# Altium schematic sheet Sheet1.SchDoc
size A2; SheetNumber: 1; SheetTotal: 1
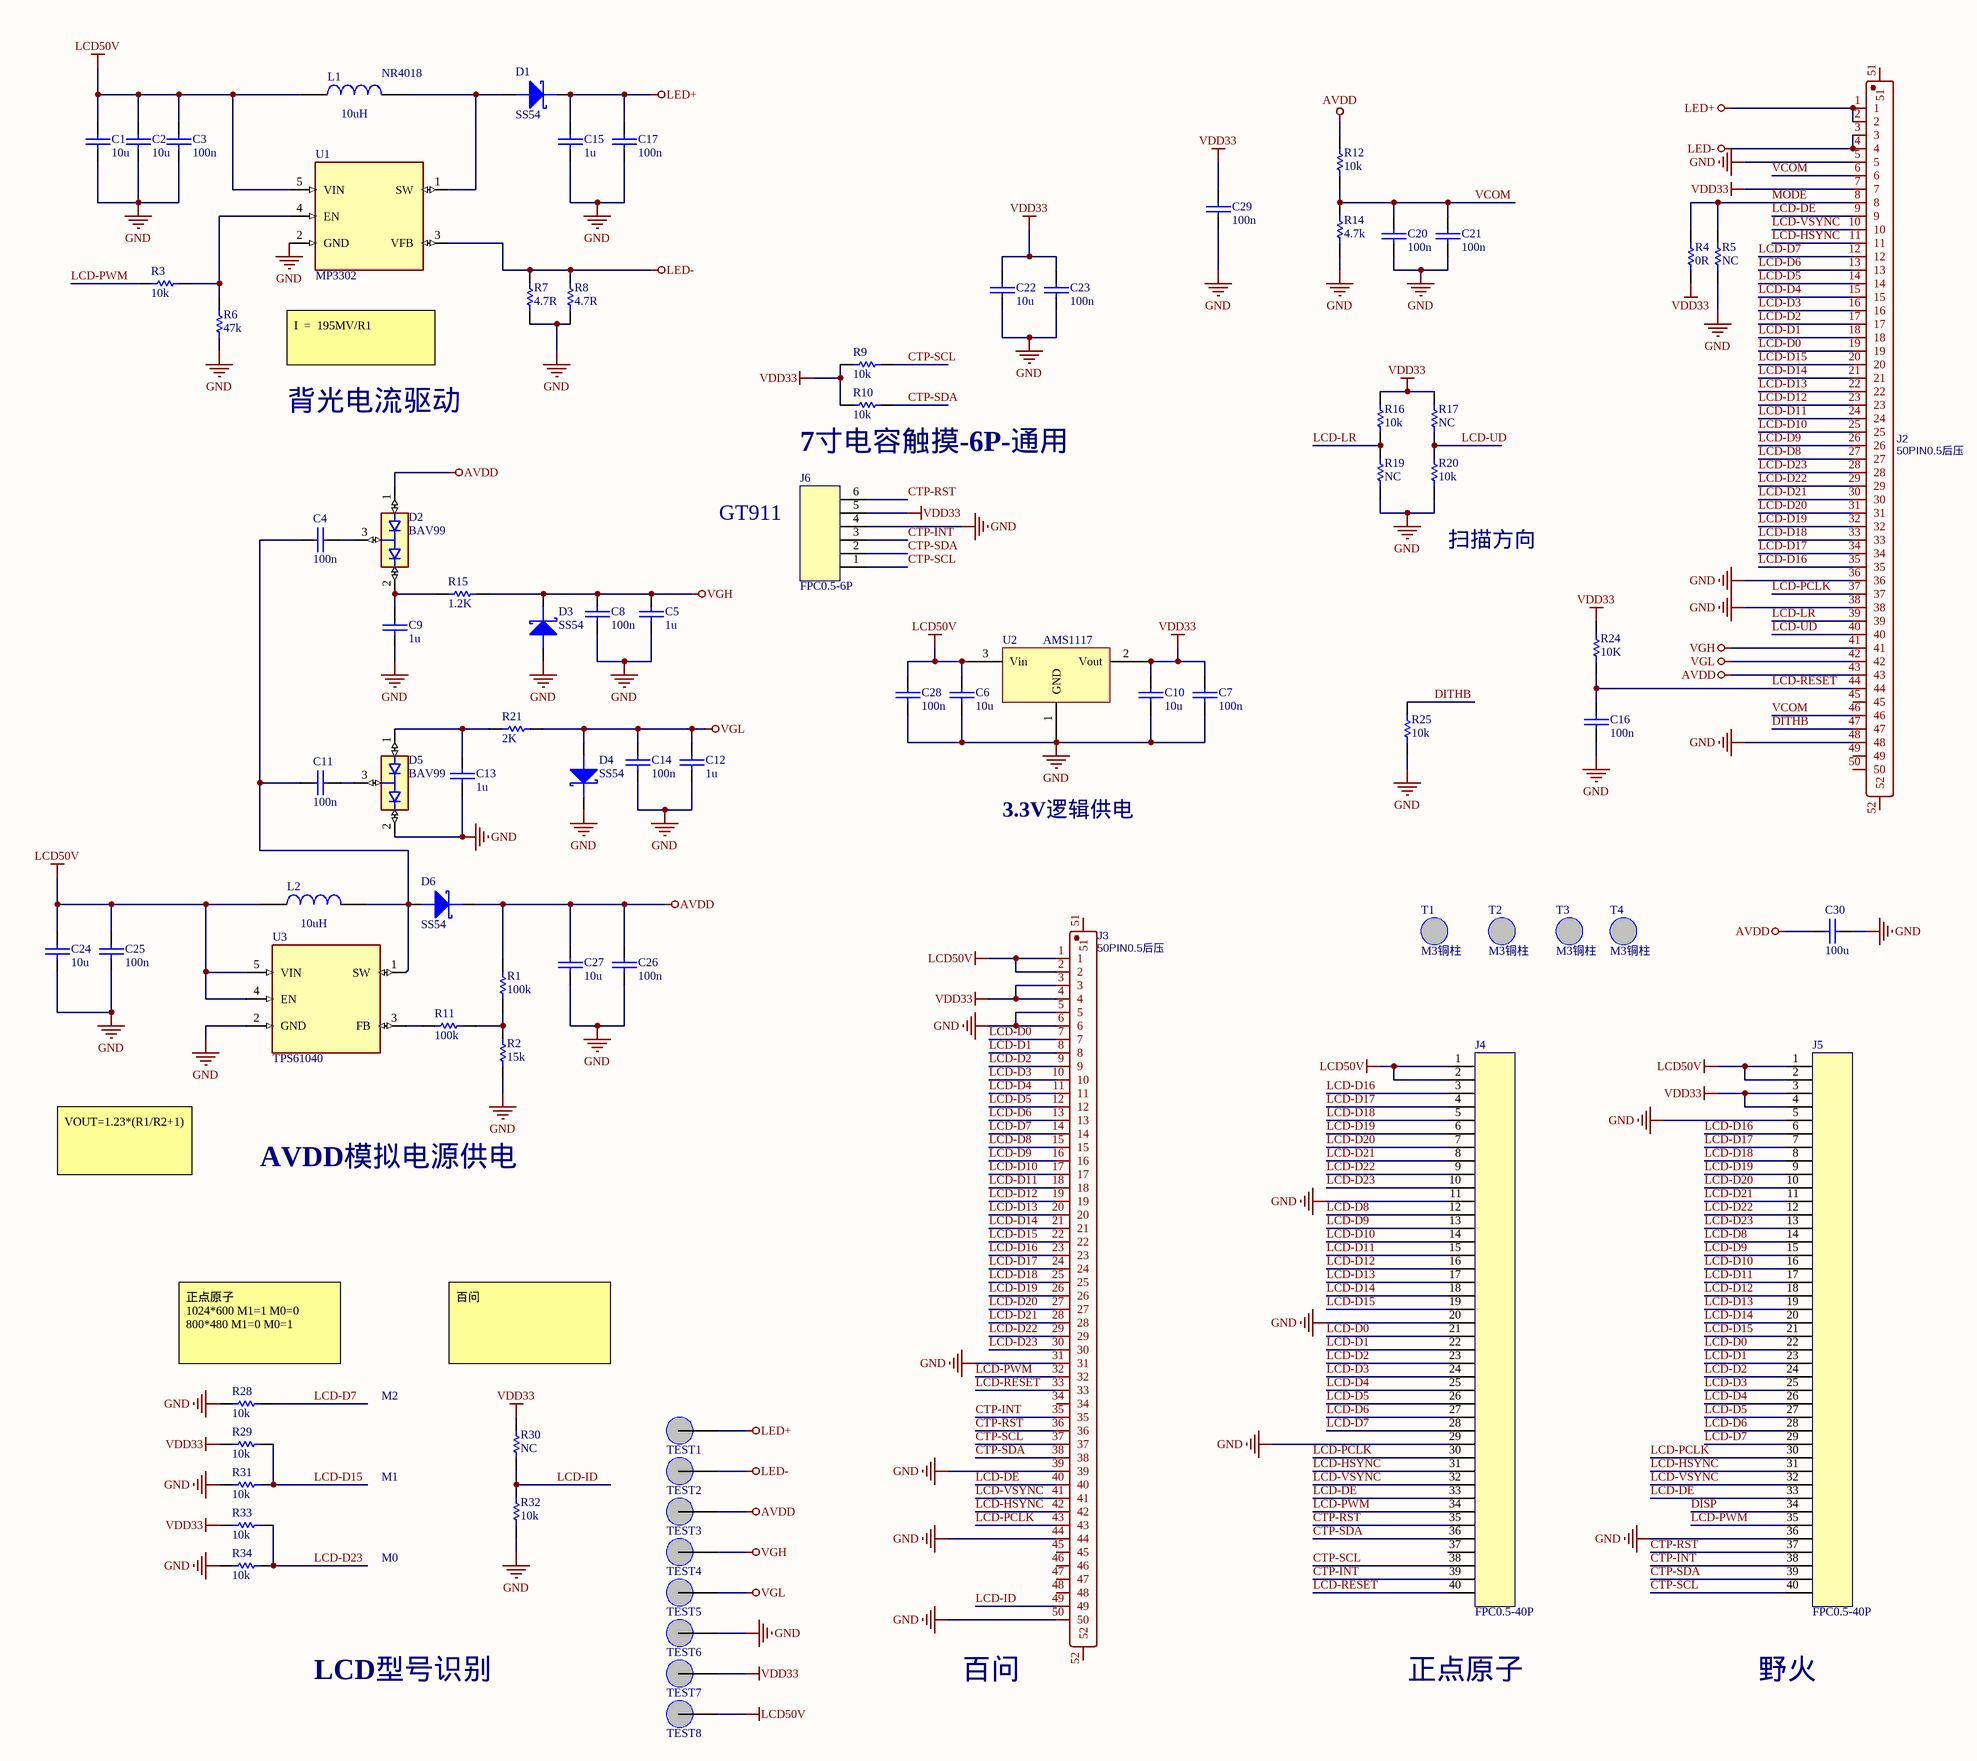
[diagram p0: Sheet1.SchDoc]

## Parts
C1  10u  [0603C]
C2  10u  [0603C]
C3  100n  [0603C]
C4  100n  [0603C]
C5  1u  [0603C]
C6  10u  [0603C]
C7  100n  [0603C]
C8  100n  [0603C]
C9  1u  [0603C]
C10  10u  [0603C]
C11  100n  [0603C]
C12  1u  [0603C]
C13  1u  [0603C]
C14  100n  [0603C]
C15  1u  [0603C]
C16  100n  [0603C]
C17  100n  [0603C]
C20  100n  [0603C]
C21  100n  [0603C]
C22  10u  [0603C]
C23  100n  [0603C]
C24  10u  [0603C]
C25  100n  [0603C]
C26  100n  [0603C]
C27  10u  [0603C]
C28  100n  [0603C]
C29  100n  [0603C]
C30  100u  [0603C]
D1  SS54  [SOD-123]
D2  BAV99  [SOT23-3]
D3  SS54  [SOD-123]
D4  SS54  [SOD-123]
D5  BAV99  [SOT23-3]
D6  SS54  [SOD-123]
J2  50PIN0.5后压  [FPC-SMD_KH-FG0.5-H2.0-50PIN]
J3  50PIN0.5后压  [FPC-SMD_KH-FG0.5-H2.0-50PIN]
J4  FPC0.5-40P  [FPC0.5-40P]
J5  FPC0.5-40P  [FPC0.5-40P]
J6  FPC0.5-6P  [FPC0.5-6P]
L1  10uH  [CD42]
L2  10uH  [CD42]
R1  100k  [0603R]
R2  15k  [0603R]
R3  10k  [0603R]
R4  0R  [0603R]
R5  NC  [0603R]
R6  47k  [0603R]
R7  4.7R  [0603R]
R8  4.7R  [0603R]
R9  10k  [0603R]
R10  10k  [0603R]
R11  100k  [0603R]
R12  10k  [0603R]
R14  4.7k  [0603R]
R15  1.2K  [0603R]
R16  10k  [0603R]
R17  NC  [0603R]
R19  NC  [0603R]
R20  10k  [0603R]
R21  2K  [0603R]
R24  10K  [0603R]
R25  10k  [0603R]
R28  10k  [0603R]
R29  10k  [0603R]
R30  NC  [0603R]
R31  10k  [0603R]
R32  10k  [0603R]
R33  10k  [0603R]
R34  10k  [0603R]
T1  M3铜柱  [M3 单孔]
T2  M3铜柱  [M3 单孔]
T3  M3铜柱  [M3 单孔]
T4  M3铜柱  [M3 单孔]
TEST1  TEST  [TEST SMALL]  (value not drawn)
TEST2  TEST  [TEST SMALL]  (value not drawn)
TEST3  TEST  [TEST SMALL]  (value not drawn)
TEST4  TEST  [TEST SMALL]  (value not drawn)
TEST5  TEST  [TEST SMALL]  (value not drawn)
TEST6  TEST  [TEST SMALL]  (value not drawn)
TEST7  TEST  [TEST SMALL]  (value not drawn)
TEST8  TEST  [TEST SMALL]  (value not drawn)
U1  MP3302  [SOT95P280X100-5N]
U2  AMS1117  [SOT223]
U3  TPS61040  [SOT95P280X100-5N]

## Nets
AVDD: C26.2 C27.2 C30.1 D2.1(A1) D6.K J2.43 R1.1 R12.1 TEST3.1
GND: C1.1 C2.1 C3.1 C5.1 C6.1 C7.1 C8.1 C9.1 C10.1 C12.1 C13.2 C14.1 C15.1 C16.1 C17.1 C20.1 C21.1 C22.1 C23.1 C24.1 C25.1 C26.1 C27.1 C28.1 C29.1 C30.2 D3.A D4.K D5.2(C2) J2.5 J2.36 J2.38 J2.48 J3.5 J3.6 J3.31 J3.39 J3.44 J3.50 J4.11 J4.20 J4.29 J5.5 J5.36 J6.4 R2.1 R5.2 R6.1 R7.1 R8.1 R14.2 R19.2 R20.2 R25.2 R28.1 R31.2 R32.1 R34.2 TEST6.1 U1.2(GND) U2.1(GND) U3.2(GND)
LCD50V: C1.2 C2.2 C3.2 C6.2 C24.2 C25.2 C28.2 J3.1 J3.2 J4.1 J4.2 J5.1 J5.2 L1.1 L2.1 TEST8.1 U1.5(VIN) U2.3(Vin) U3.4(EN) U3.5(VIN)
LED+: C15.2 C17.2 D1.K J2.1 J2.2 TEST1.1
LED-: J2.3 J2.4 R7.2 R8.2 TEST2.1 U1.3(VFB)
VDD33: C7.2 C10.2 C22.2 C23.2 C29.2 J2.7 J3.3 J3.4 J5.3 J5.4 J6.5 R4.2 R9.2 R10.2 R16.1 R17.1 R24.1 R29.1 R30.1 R33.1 TEST7.1 U2.2(Vout)
VGH: C5.2 C8.2 D3.K J2.41 R15.2 TEST4.1
VGL: C12.2 C14.2 D4.A J2.42 R21.2 TEST5.1
CTP-INT: J3.35 J4.39 J5.38 J6.3
CTP-RST: J3.36 J4.35 J5.37 J6.6
CTP-SCL: J3.37 J4.38 J5.40 J6.1 R9.1
CTP-SDA: J3.38 J4.36 J5.39 J6.2 R10.1
DISP: J5.34
DITHB: J2.47 R25.1
LCD-D0: J2.19 J3.7 J4.21 J5.22
LCD-D1: J2.18 J3.8 J4.22 J5.23
LCD-D2: J2.17 J3.9 J4.23 J5.24
LCD-D3: J2.16 J3.10 J4.24 J5.25
LCD-D4: J2.15 J3.11 J4.25 J5.26
LCD-D5: J2.14 J3.12 J4.26 J5.27
LCD-D6: J2.13 J3.13 J4.27 J5.28
LCD-D7: J2.12 J3.14 J4.28 J5.29 R28.2
LCD-D8: J2.27 J3.15 J4.12 J5.14
LCD-D9: J2.26 J3.16 J4.13 J5.15
LCD-D10: J2.25 J3.17 J4.14 J5.16
LCD-D11: J2.24 J3.18 J4.15 J5.17
LCD-D12: J2.23 J3.19 J4.16 J5.18
LCD-D13: J2.22 J3.20 J4.17 J5.19
LCD-D14: J2.21 J3.21 J4.18 J5.20
LCD-D15: J2.20 J3.22 J4.19 J5.21 R29.2 R31.1
LCD-D16: J2.35 J3.23 J4.3 J5.6
LCD-D17: J2.34 J3.24 J4.4 J5.7
LCD-D18: J2.33 J3.25 J4.5 J5.8
LCD-D19: J2.32 J3.26 J4.6 J5.9
LCD-D20: J2.31 J3.27 J4.7 J5.10
LCD-D21: J2.30 J3.28 J4.8 J5.11
LCD-D22: J2.29 J3.29 J4.9 J5.12
LCD-D23: J2.28 J3.30 J4.10 J5.13 R33.2 R34.1
LCD-DE: J2.9 J3.40 J4.33 J5.33
LCD-HSYNC: J2.11 J3.42 J4.31 J5.31
LCD-ID: J3.49 R30.2 R32.2
LCD-LR: J2.39 R16.2 R19.1
LCD-PCLK: J2.37 J3.43 J4.30 J5.30
LCD-PWM: J3.32 J4.34 J5.35 R3.1
LCD-RESET: C16.2 J2.44 J3.33 J4.40 R24.2
LCD-UD: J2.40 R17.2 R20.1
LCD-VSYNC: J2.10 J3.41 J4.32 J5.32
MODE: J2.8 R4.1 R5.1
VCOM: C20.2 C21.2 J2.6 J2.46 R12.2 R14.1
NetC4_1: C4.1 D2.3(COM)
NetC4_2: C4.2 C11.2 D6.A L2.2 U3.1(SW)
NetC9_2: C9.2 D2.2(C2) R15.1
NetC11_1: C11.1 D5.3(COM)
NetC13_1: C13.1 D5.1(A1) R21.1
NetD1_A: D1.A L1.2 U1.1(SW)
NetR1_2: R1.2 R2.2 R11.2
NetR3_2: R3.2 R6.2 U1.4(EN)
NetR11_1: R11.1 U3.3(FB)

Not connected (* = marked no-connect by the designer): J2 45 49 50 51 52; J3 34 45 46 47 48 51 52; J4 37

## Notes on the sheet
- (near L1) NR4018
- I  =  195MV/R1
- 背光电流驱动
- (near R10) 7寸电容触摸-6P-通用
- GT911
- (near R20) 扫描方向
- 3.3V逻辑供电
- VOUT=1.23*(R1/R2+1)
- AVDD模拟电源供电
- (near R28) 正点原子
  1024*600 M1=1 M0=0
  800*480 M1=0 M0=1
- 百问
- M2
- M1
- M0
- LCD型号识别
- 正点原子
- 野火

## Library data of the parts
C1-C17 C20-C30 = CAP: 无极性电容
D1 D3 D4 D6 = DIODE SCHOTTKY: 肖特基二极管
D2 D5 = BAV99: Two small signal silicon diodes connected anode to cathode.<br> Connections to all three nodes available.<br> DIO-10647; MF: {'manufacturer': u'ON Semiconductor'}; MP: BAV99; Value: *; Price: None; Package: None; Availability: Unavailable
J2 J3 = 50PIN0.5后压: BOM_Manufacturer: null; Contributor: LCSC; BOM_Supplier: LCSC; BOM_Supplier Part: C9900011403; BOM_Manufacturer Part: 50PIN0.5后压; BOM_JLCPCB Part Class: Extended Part; spicePre: C; spiceSymbolName: 50PIN0.5后压
J4 J5 = FPC0.5-40P: 贴片
J6 = FPC0.5-6P: 贴片
L1 L2 = INDUCTOR
R1-R12 R14-R17 R19-R21 R24 R25 R28-R34 = RES
TEST1-TEST8 = TEST: 测试针; BOM名称: 耳机插座; 版权归属: 源创客; 学习资源: www.ooocke.com
U1 = MP3302: MP: TPS563201DDCR; MF: {'manufacturer': u'Texas Instruments'}; Price: None; Availability: Unavailable; Package: None; Value: *
U2 = AMS1117: 三端稳压芯片
U3 = MP1541: MP: TPS563201DDCR; MF: {'manufacturer': u'Texas Instruments'}; Price: None; Availability: Unavailable; Package: None; Value: *